# Altium schematic sheet Power.SchDoc
size A4
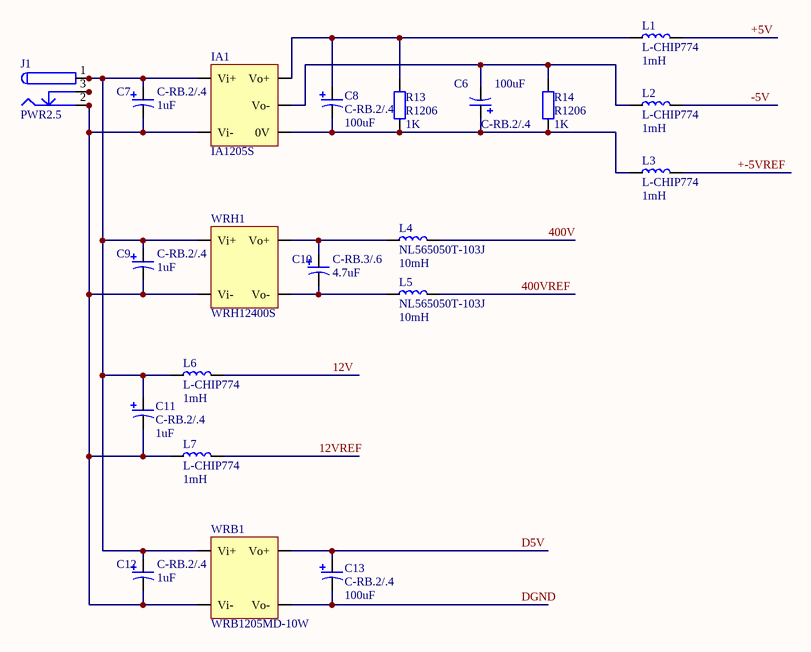
[diagram p0: Power.SchDoc]

## Parts
C6  C-RB.2/.4  value 100uF  [RB.2/.4]
C7  C-RB.2/.4  value 1uF  [RB.2/.4]
C8  C-RB.2/.4  value 100uF  [RB.2/.4]
C9  C-RB.2/.4  value 1uF  [RB.2/.4]
C10  C-RB.3/.6  value 4.7uF  [RB.3/.6]
C11  C-RB.2/.4  value 1uF  [RB.2/.4]
C12  C-RB.2/.4  value 1uF  [RB.2/.4]
C13  C-RB.2/.4  value 100uF  [RB.2/.4]
IA1  IA1205S  [IA1205S]
J1  PWR2.5  [KLD-0202]
L1  L-CHIP774  value 1mH  [INDUCTOR070704]
L2  L-CHIP774  value 1mH  [INDUCTOR070704]
L3  L-CHIP774  value 1mH  [INDUCTOR070704]
L4  NL565050T-103J  value 10mH  [NL565050T]
L5  NL565050T-103J  value 10mH  [NL565050T]
L6  L-CHIP774  value 1mH  [INDUCTOR070704]
L7  L-CHIP774  value 1mH  [INDUCTOR070704]
R13  R1206  value 1K  [1206]
R14  R1206  value 1K  [1206]
WRB1  WRB1205MD-10W  [WRB1205MD-10W]
WRH1  WRH12400S  [WRH12400S]

## Nets
12V: L6.2
12VREF: L7.2
400V: L4.2
400VREF: L5.2
+5V: L1.2
+-5VREF: L3.2
-5V: L2.2
D5V: C13.2(b) WRB1.3(Vo+)
DGND: C13.1(a) WRB1.5(Vo-)
NetC6_1: C6.1(a) IA1.9(Vo-) L2.1 R14.2(b)
NetC6_2: C6.2(b) C8.1(a) IA1.10(0V) L3.1 R13.1(a) R14.1(a)
NetC7_1: C7.1(a) C9.1(a) C11.1(a) C12.1(a) IA1.2(Vi-) J1.2 J1.2A J1.2B L7.1 WRB1.2(Vi-) WRH1.2(Vi-)
NetC7_2: C7.2(b) C9.2(b) C11.2(b) C12.2(b) IA1.1(Vi+) J1.1 J1.1A J1.1B L6.1 WRB1.1(Vi+) WRH1.1(Vi+)
NetC8_2: C8.2(b) IA1.7(Vo+) L1.1 R13.2(b)
NetC10_1: C10.1(a) L5.1 WRH1.5(Vo-)
NetC10_2: C10.2(b) L4.1 WRH1.3(Vo+)
NetJ1_3: J1.3 J1.3A J1.3B

## Library data of the parts
C6-C9 C11-C13 = C-RB.2/.4: Capacitor
C10 = C-RB.3/.6: Capacitor
IA1 = IA1205S: IA1205S,12V to +5V,-5V
J1 = PWR2.5: Low Voltage Power Supply Connector; Published: 17-Dec-2003; DatasheetDocument: 09-May-2002; Publisher: Altium Limited; ComponentLink1Description: Manufacturer Link; ComponentLink1URL: http://domino.kycon.com/internet/Products.html
L1-L3 L6 L7 = Inductor070704: Chip Inductor, 7*7*4
L4 L5 = NL565050T-103J: NL565050T, 10mH, 150 ohm
R13 R14 = R1206: Resistor, 1206, 1/4W
WRB1 = WRB1205MD-10W: WRB1205MD-10W,12V-5V
WRH1 = WRH12400S: WRH12400S,12V-400V